# EAGLE design generic-switch-board (EAGLE 7.2.0)
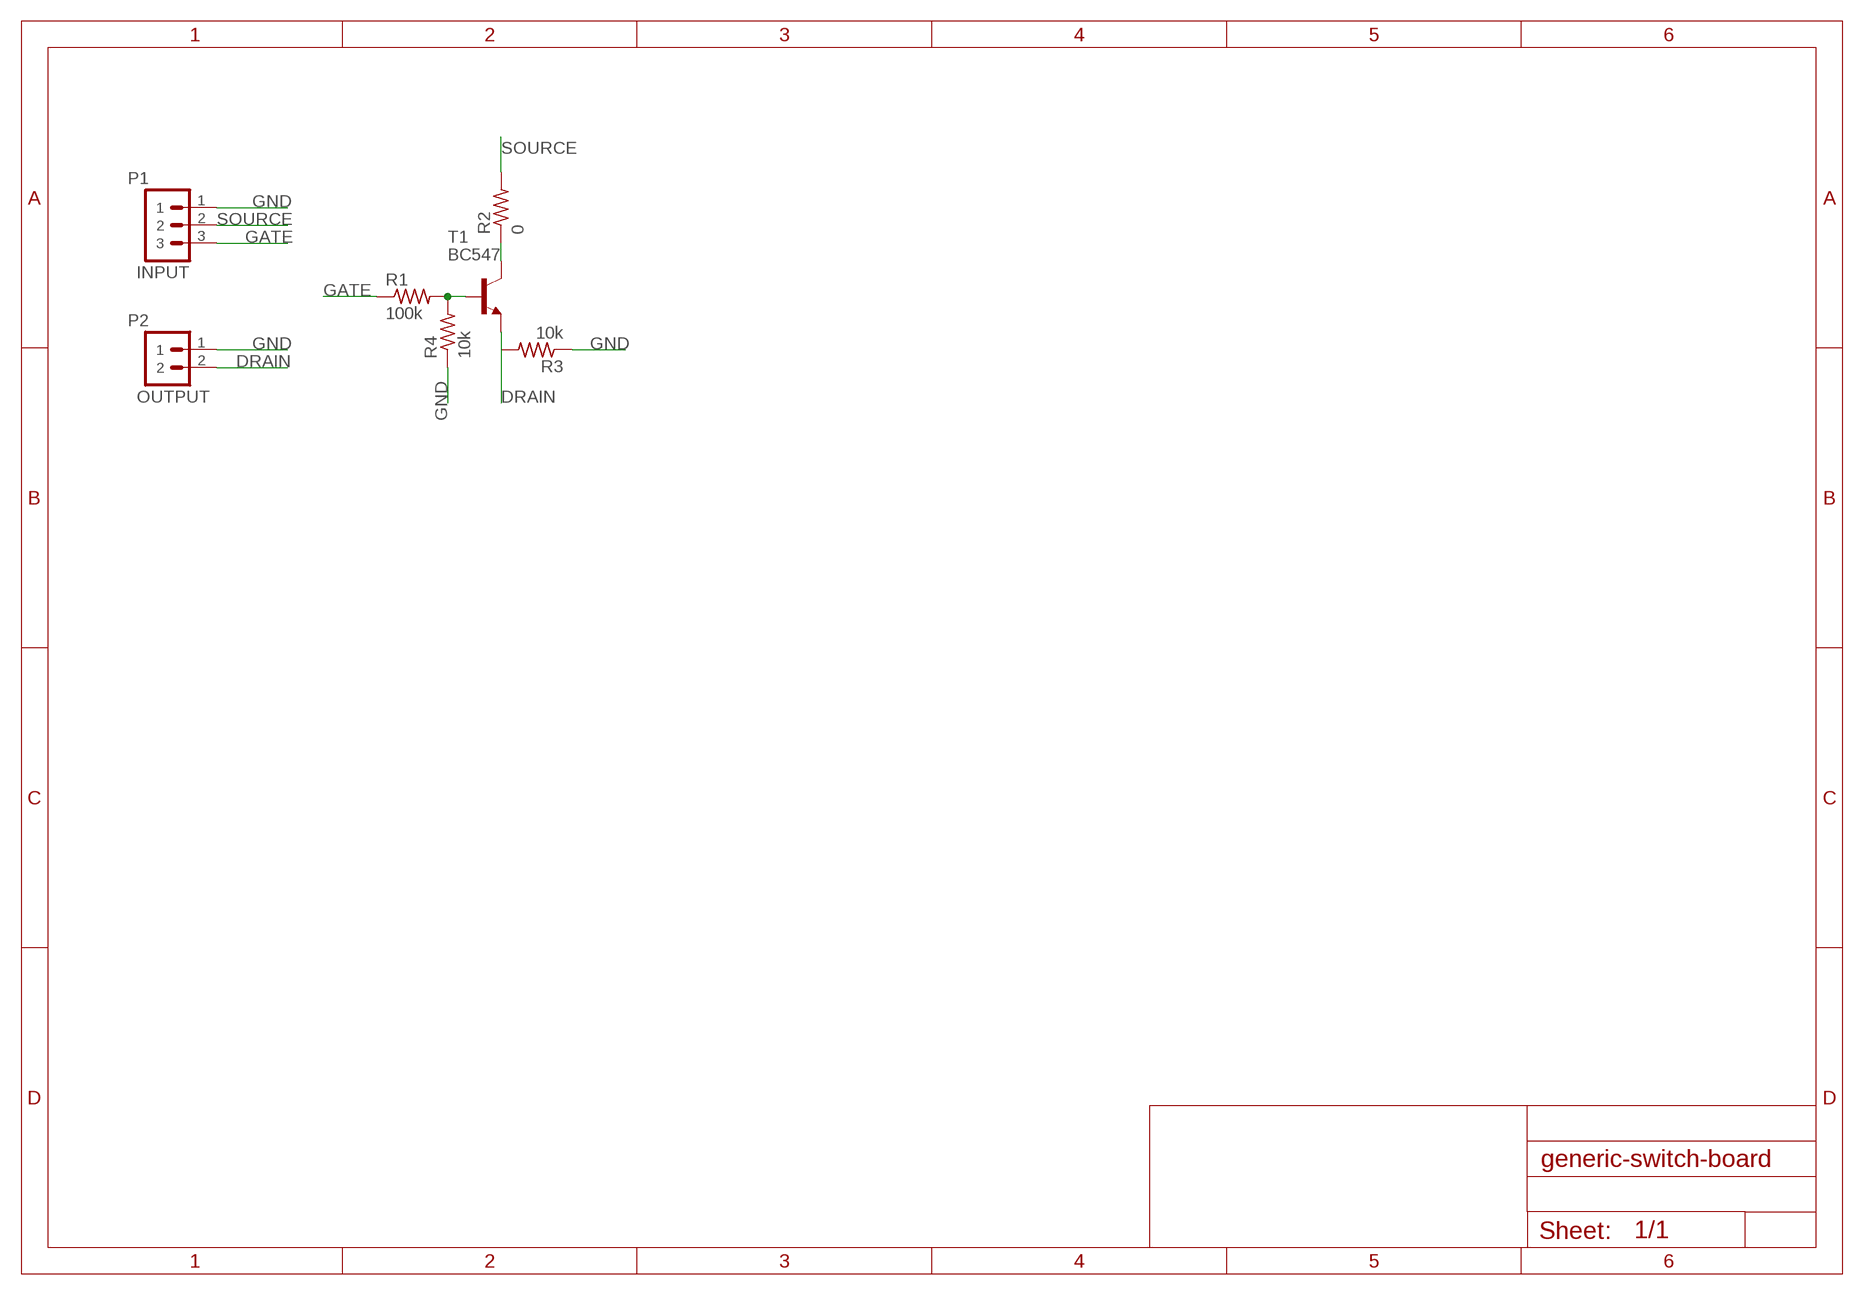
[diagram p0: schematic, sheet 1]

## Parts
P1  IN  PIN-HEADER-3PIN  [PIN-HEADER-3PIN]
P2  OUT  PIN-HEADER-2PIN  [PIN-HEADER-2PIN]
R1  100k  RESISTORV3  [RESISTOR-V3]
R2  0  RESISTORV2  [RESISTOR-V2]
R3  10k  RESISTORV1  [RESISTOR-V1]
R4  10k  RESISTORV1  [RESISTOR-V1]
T1  BC547  2N3904  [TO-92-FLAT]

## Nets
DRAIN: P2.2 R3.2 T1.1(E)
GATE: P1.3 R1.1
GND: P1.1 P2.1 R3.1 R4.1
N$1: R1.2 R4.2 T1.2(B)
N$6: R2.1 T1.3(C)
SOURCE: P1.2 R2.2

## Notes on the sheet
- INPUT
- OUTPUT

## Library data of the parts
P1 = stutz-eagle:PIN-HEADER-3PIN
P2 = stutz-eagle:PIN-HEADER-2PIN
R1-R4 = stutz-eagle:RESISTOR
T1 = stutz-eagle:2N3904

## Net classes
0 default: width 0.381 mm, clearance 0.355 mm
1 power-4A: width 2.642 mm
2 comm-rs485: width 1.016 mm
3 power-2A: width 1.143 mm

## Board
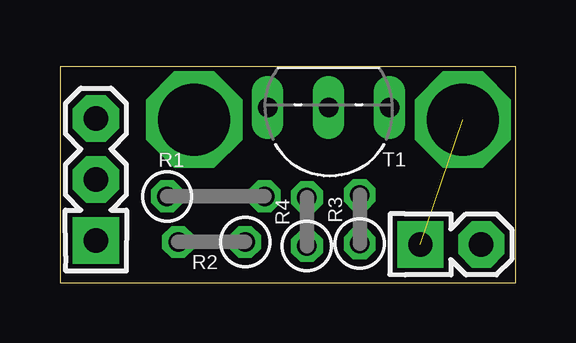
[diagram p1: board, top side]
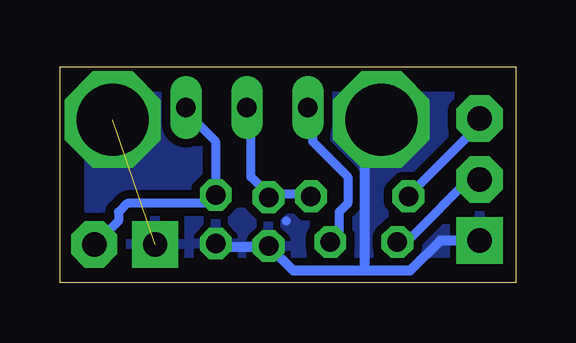
[diagram p2: board, bottom side, seen from below]

Size 19 x 9 mm. Coordinates in mm from the lower left corner, seen from the top.
Outline: 0,0 19,0 19,9 0,9 0,0
Copper layers (1*16): Top 0.035mm / dielectric 1.5mm / Bottom 0.035mm
Design rules "generic-switch-board": minimum track width 10mil, minimum drill 0.6mm, track to track 0.205mm, track to pad 0.205mm, pad to pad 0.205mm, via to via 0.205mm, smd to smd 8mil, copper to edge 40mil, drill to drill 8mil, minimum pad ring 10mil, minimum via ring 8mil, stop-mask expansion 4mil, vias tented up to drill 0mil, thermal gap 10mil

### Footprints (pad centres in the part's own frame; a part is rotated, then mirrored left to right if it is on the bottom)
PIN-HEADER-3PIN = drill 1.016 pad 1.93 square: 1 -2.54,0 | drill 1.016 pad 1.93 octagon: 2 0,0; 3 2.54,0
PIN-HEADER-2PIN = drill 1.016 pad 1.93 square: 1 -1.27,0 | drill 1.016 pad 1.93 octagon: 2 1.27,0
RESISTOR-V3 = drill 0.813 octagon: 1 -2.032,0; 2 2.032,0
RESISTOR-V2 = drill 0.813 octagon: 1 -1.524,0; 2 1.27,0
RESISTOR-V1 = drill 0.813 octagon: 1 -1.27,0; 2 0.762,0
TO-92-FLAT = drill 0.813 long: 1 -2.54,0; 2 0,0; 3 2.54,0

### Placement (x,y rotation side)
P1  1.5,4.3 90 top
P2  16.3,1.6 0 top
R1  6.5,3.6 0 top
R2  6.2,1.7 180 top
R3  12.5,2.9 90 top
R4  10.3,2.8 90 top
T1  11.2,7.3 180 top

### Tracks (layer width: path | path; a pad name or v marks a point on that pad's centre or on a via)
DRAIN
  Bottom 0.381: T1.1 13.62,6.99 12.51,5.89 12.51,3.68 R3.2 12.51,3.31 16.19,3.31 16.56,2.94 16.56,2.58 17.3,1.84 P2.2
GATE
  Bottom 0.381: R1.1 4.42,3.68 1.47,6.62 P1.3
GND  (via drill 3)  (1 unrouted)
  Bottom 0.381: R4.1 10.3,1.47 R4.1 | 9.57,2.58 9.56,2.57 | R4.1 9.94,1.47 9.94,1.53
  Bottom 0.406: P1.1 3.14,1.76 4.4,0.5 6.3,0.5 | 6.3,0.5 9.27,0.5 R4.1 | 10.3,1.47 12.34,1.47 R3.1 | v5.6,6.8 6.3,6.1 6.3,0.5
  other vias: 16.8,6.8
  pour Bottom: -2.8,10.8 -2.2,-0.7 21.4,-1 20.3,10.5
N$1
  Bottom 0.381: R1.2 8.83,3.68 9.94,3.68 R4.2 10.3,3.68 11.04,4.42 11.04,6.99 T1.2
N$6
  Bottom 0.381: R2.1 7.36,1.84 7.36,2.94 6.99,3.31 6.99,4.42 8.46,5.89 8.46,6.99 T1.3
SOURCE
  Bottom 0.381: R2.2 4.78,1.84 4.42,1.84 1.84,4.42 P1.2

### Text on the board
tValues: GND SRC GATE | GND DRAIN